# EAGLE design lab_sist_dig (EAGLE 9.6.2)
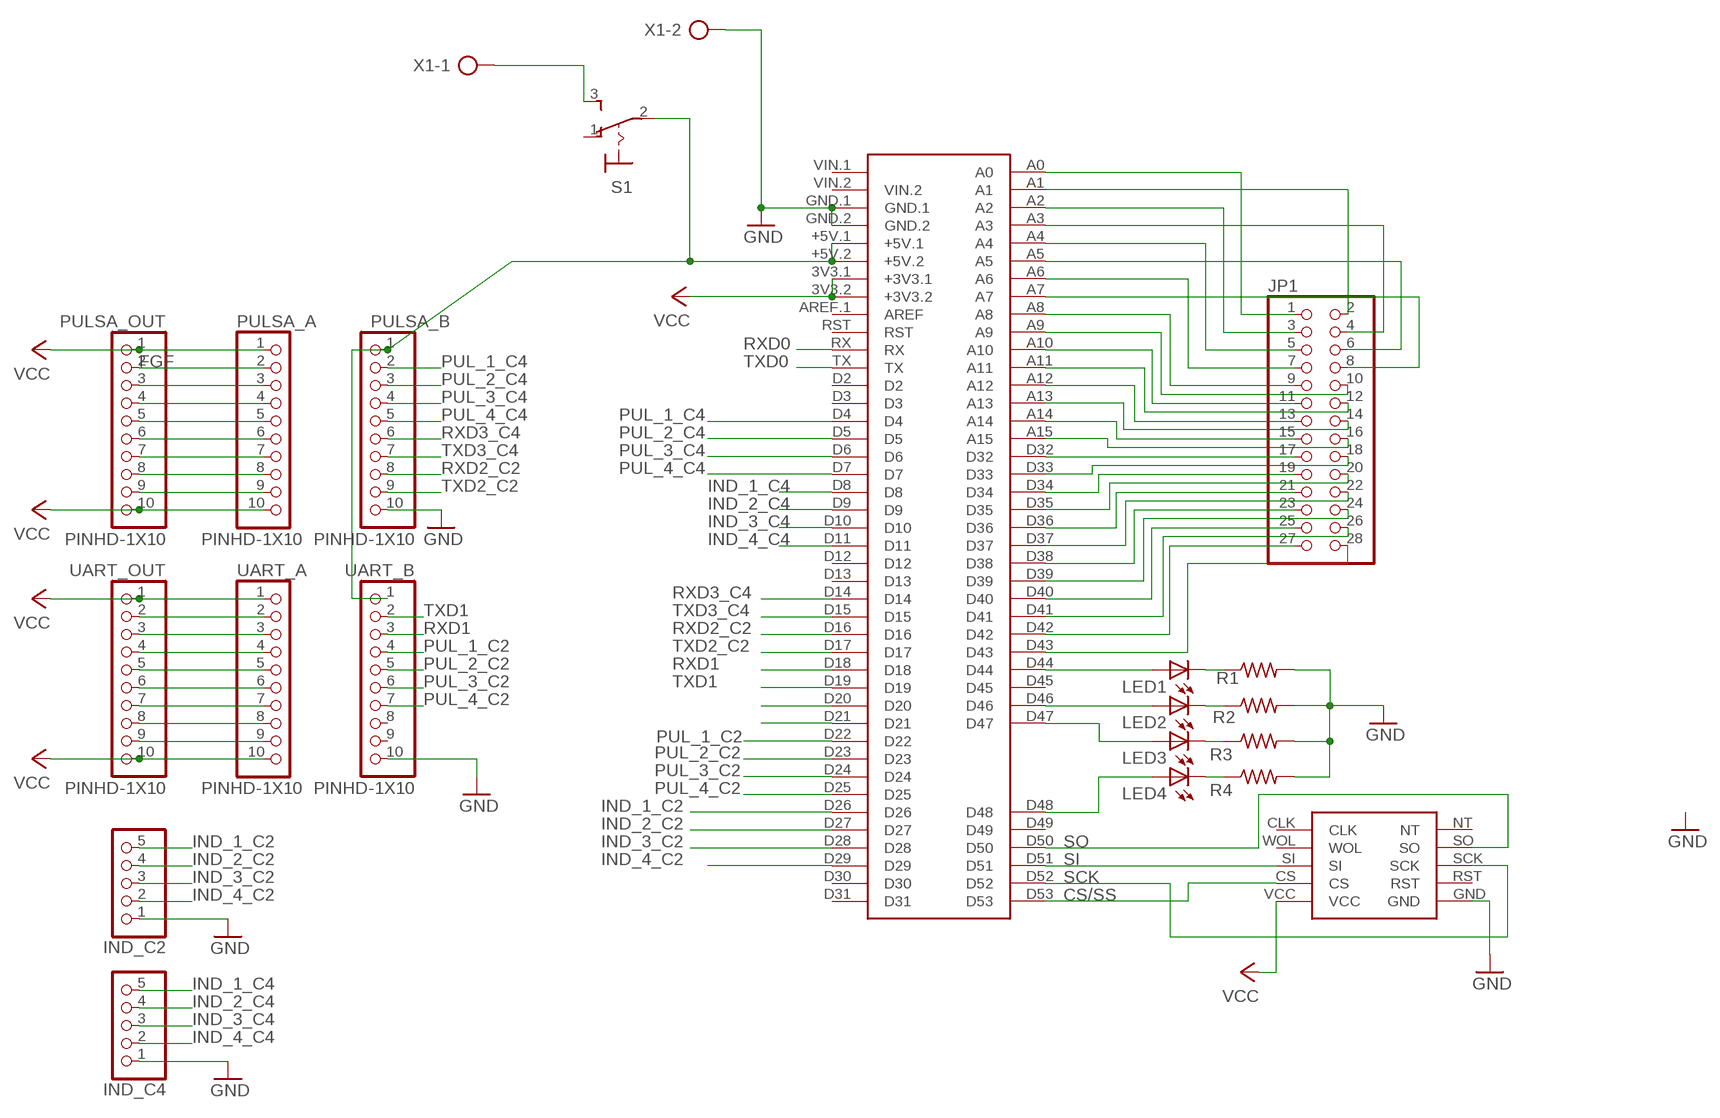
[diagram p0: schematic, sheet 1]

## Parts
IND_C2  PINHD-1X5  [1X05]
IND_C4  PINHD-1X5  [1X05]
JP1  PINHD-2X14  [2X14]
LED1  LED3MM  [LED3MM]
LED2  LED3MM  [LED3MM]
LED3  LED3MM  [LED3MM]
LED4  LED3MM  [LED3MM]
PULSA_A  PINHD-1X10  [1X10-BIG]
PULSA_B  PINHD-1X10  [1X10-BIG]
PULSA_OUT  PINHD-1X10  [1X10-BIG]
R1  FLIPFLOP-RES  [0805-THM]
R2  FLIPFLOP-RES  [0805-THM]
R3  FLIPFLOP-RES  [0805-THM]
R4  FLIPFLOP-RES  [0805-THM]
S1  320-916  [320-916]
U$1  MEGA2560_MIKRO  [MEGA2560_MIKRO]
U$2  ENC28J60  [ENC28J60]
UART_A  PINHD-1X10  [1X10-BIG]
UART_B  PINHD-1X10  [1X10-BIG]
UART_OUT  PINHD-1X10  [1X10-BIG]
X1  AK300/2  [AK300/2]

## Nets
CS/SS: U$1.D53 U$2.CS
FGF: PULSA_A.2 PULSA_OUT.2
GND: IND_C2.1 IND_C4.1 PULSA_B.10 R1.2 R2.2 R3.2 R4.2 U$1.GND.1 U$1.GND.2 U$2.GND UART_B.10 X1.2
IND_1_C2: IND_C2.5 U$1.D26
IND_1_C4: IND_C4.5 U$1.D8
IND_2_C2: IND_C2.4 U$1.D27
IND_2_C4: IND_C4.4 U$1.D9
IND_3_C2: IND_C2.3 U$1.D28
IND_3_C4: IND_C4.3 U$1.D10
IND_4_C2: IND_C2.2 U$1.D29
IND_4_C4: IND_C4.2 U$1.D11
N$1: LED1.A U$1.D44
N$2: LED2.A U$1.D46
N$4: PULSA_A.3 PULSA_OUT.3
N$5: PULSA_A.4 PULSA_OUT.4
N$6: PULSA_A.5 PULSA_OUT.5
N$7: PULSA_A.6 PULSA_OUT.6
N$8: PULSA_A.7 PULSA_OUT.7
N$9: PULSA_A.8 PULSA_OUT.8
N$10: PULSA_A.9 PULSA_OUT.9
N$11: U$1.D20
N$12: U$1.D21
N$13: UART_A.2 UART_OUT.2
N$14: PULSA_B.1 S1.2(P) U$1.+5V.1 U$1.+5V.2 UART_B.1
N$15: UART_A.3 UART_OUT.3
N$16: UART_A.5 UART_OUT.5
N$17: UART_A.4 UART_OUT.4
N$18: UART_A.6 UART_OUT.6
N$19: UART_A.7 UART_OUT.7
N$20: UART_A.8 UART_OUT.8
N$21: UART_A.9 UART_OUT.9
N$22: S1.3(S) X1.1
N$23: JP1.1 U$1.A0
N$24: JP1.2 U$1.A1
N$25: JP1.3 U$1.A2
N$26: JP1.7 U$1.A6
N$27: JP1.5 U$1.A4
N$28: JP1.6 U$1.A5
N$29: LED3.A U$1.D47
N$30: LED4.A U$1.D48
N$31: LED1.K(C) R1.1
N$32: LED2.K(C) R2.1
N$33: JP1.4 U$1.A3
N$34: LED3.K(C) R3.1
N$35: LED4.K(C) R4.1
N$36: JP1.8 U$1.A7
N$37: JP1.9 U$1.A8
N$38: JP1.11 U$1.A10
N$39: JP1.13 U$1.A12
N$40: JP1.15 U$1.A14
N$41: JP1.17 U$1.D32
N$42: JP1.19 U$1.D34
N$43: JP1.21 U$1.D36
N$44: JP1.23 U$1.D38
N$45: JP1.25 U$1.D40
N$46: JP1.16 U$1.A15
N$47: JP1.10 U$1.A9
N$48: JP1.20 U$1.D35
N$49: JP1.12 U$1.A11
N$50: JP1.14 U$1.A13
N$51: JP1.18 U$1.D33
N$52: JP1.22 U$1.D37
N$53: JP1.24 U$1.D39
N$54: JP1.26 U$1.D41
N$55: JP1.27 U$1.D42
N$56: JP1.28 U$1.D43
PUL_1_C2: U$1.D22 UART_B.4
PUL_1_C4: PULSA_B.2 U$1.D4
PUL_2_C2: U$1.D23 UART_B.5
PUL_2_C4: PULSA_B.3 U$1.D5
PUL_3_C2: U$1.D24 UART_B.6
PUL_3_C4: PULSA_B.4 U$1.D6
PUL_4_C2: U$1.D25 UART_B.7
PUL_4_C4: PULSA_B.5 U$1.D7
RXD0: U$1.RX
RXD1: U$1.D18 UART_B.3
RXD2_C2: PULSA_B.8 U$1.D16
RXD3_C4: PULSA_B.6 U$1.D14
SCK: U$1.D52 U$2.SCK
SI: U$1.D51 U$2.SI
SO: U$1.D50 U$2.SO
TXD0: U$1.TX
TXD1: U$1.D19 UART_B.2
TXD2_C2: PULSA_B.9 U$1.D17
TXD3_C4: PULSA_B.7 U$1.D15
VCC: PULSA_A.1 PULSA_A.10 PULSA_OUT.1 PULSA_OUT.10 U$1.3V3.1(+3V3.1) U$1.3V3.2(+3V3.2) U$2.VCC UART_A.1 UART_A.10 UART_OUT.1 UART_OUT.10
Unconnected: S1.1(O) U$1.AREF.1(AREF) U$1.D2 U$1.D3 U$1.D12 U$1.D13 U$1.D30 U$1.D31 U$1.D45 U$1.D49 U$1.RST U$1.VIN.1 U$1.VIN.2 U$2.CLK U$2.NT U$2.RST U$2.WOL UART_B.8 UART_B.9

## Library data of the parts
IND_C2 IND_C4 = pinhead:PINHD-1X5: PIN HEADER
JP1 = adafruit:PINHD-2X14: PIN HEADER
LED1-LED4 = adafruit:LED: LED OSRAM: - CHIPLED LG R971, LG N971, LY N971, LG Q971, LY Q971, LO R971, LY R971 LH N974, LH R974 LS Q976, LO Q976, LY Q976 LO Q996 - Hyper CHIPLED LW Q18S LB Q993, LB Q99A, LB R99A - SideLED LS A670, LO A670, LY A670, LG A670, LP A670 LB A673, LV A673, LT A673, LW A673 LH A674 LY A675 LS A676, LA A676, LO A676, LY A676, LW A676 LS A679, LY A679, LG A679 - Hyper Micro SIDELED® LS Y876, LA Y876, LO Y876, LY Y876 LT Y87S - SmartLED LW L88C, LW L88S LB L89C, LB L89S, LG L890 LS L89K, LO L89K, LY L89K LS L896, LA L896, LO L896, LY L896 - TOPLED LS T670, LO T670, LY T670, LG T670, LP T670 LSG T670, LSP T670, LSY T670, LOP T670, LYG T670 LG T671, LOG T671, LSG T671 LB T673, LV T673, LT T673, LW T673 LH T674 LS T676, LA T676, LO T676, LY T676, LB T676, LH T676, LSB T676, LW T676 LB T67C, LV T67C, LT T67C, LS T67K, LO T67K, LY T67K, LW E67C LS E67B, LA E67B, LO E67B, LY E67B, LB E67C, LV E67C, LT E67C LW T67C LS T679, LY T679, LG T679 LS T770, LO T770, LY T770, LG T770, LP T770 LB T773, LV T773, LT T773, LW T773 LH T774 LS E675, LA E675, LY E675, LS T675 LS T776, LA T776, LO T776, LY T776, LB T776 LHGB T686 LT T68C, LB T68C - Hyper Mini TOPLED® LB M676 - Mini TOPLED Santana® LG M470 LS M47K, LO M47K, LY M47K Source: http://www.osram.convergy.de/
PULSA_A PULSA_B PULSA_OUT UART_A UART_B UART_OUT = adafruit:PINHD-1X10: Pin header 1x10 0.1" spacing With round pins
R1-R4 = adafruit:FLIPFLOP-RES: Flip Flop resistor An 0805 resistor inside a standard 1/4W 5% resistor. Makes for easy mods
S1 = switch:320-916: TOGGLE SWITCH distributor RS Components
U$1 = MIKRO_MEGA2560:MEGA2560_MIKRO: Arduino Mega2560 pro robotDyn, create by mikroavr.com
U$2 = ethernet-mikroavr:ENC28J60: ENC28J60, SHIELD EHTERNET, CREATE BY MIKROAVR.COM
X1 = con-ptr500:AK300/2: CONNECTOR; OC_FARNELL: unknown; OC_NEWARK: unknown

## Board
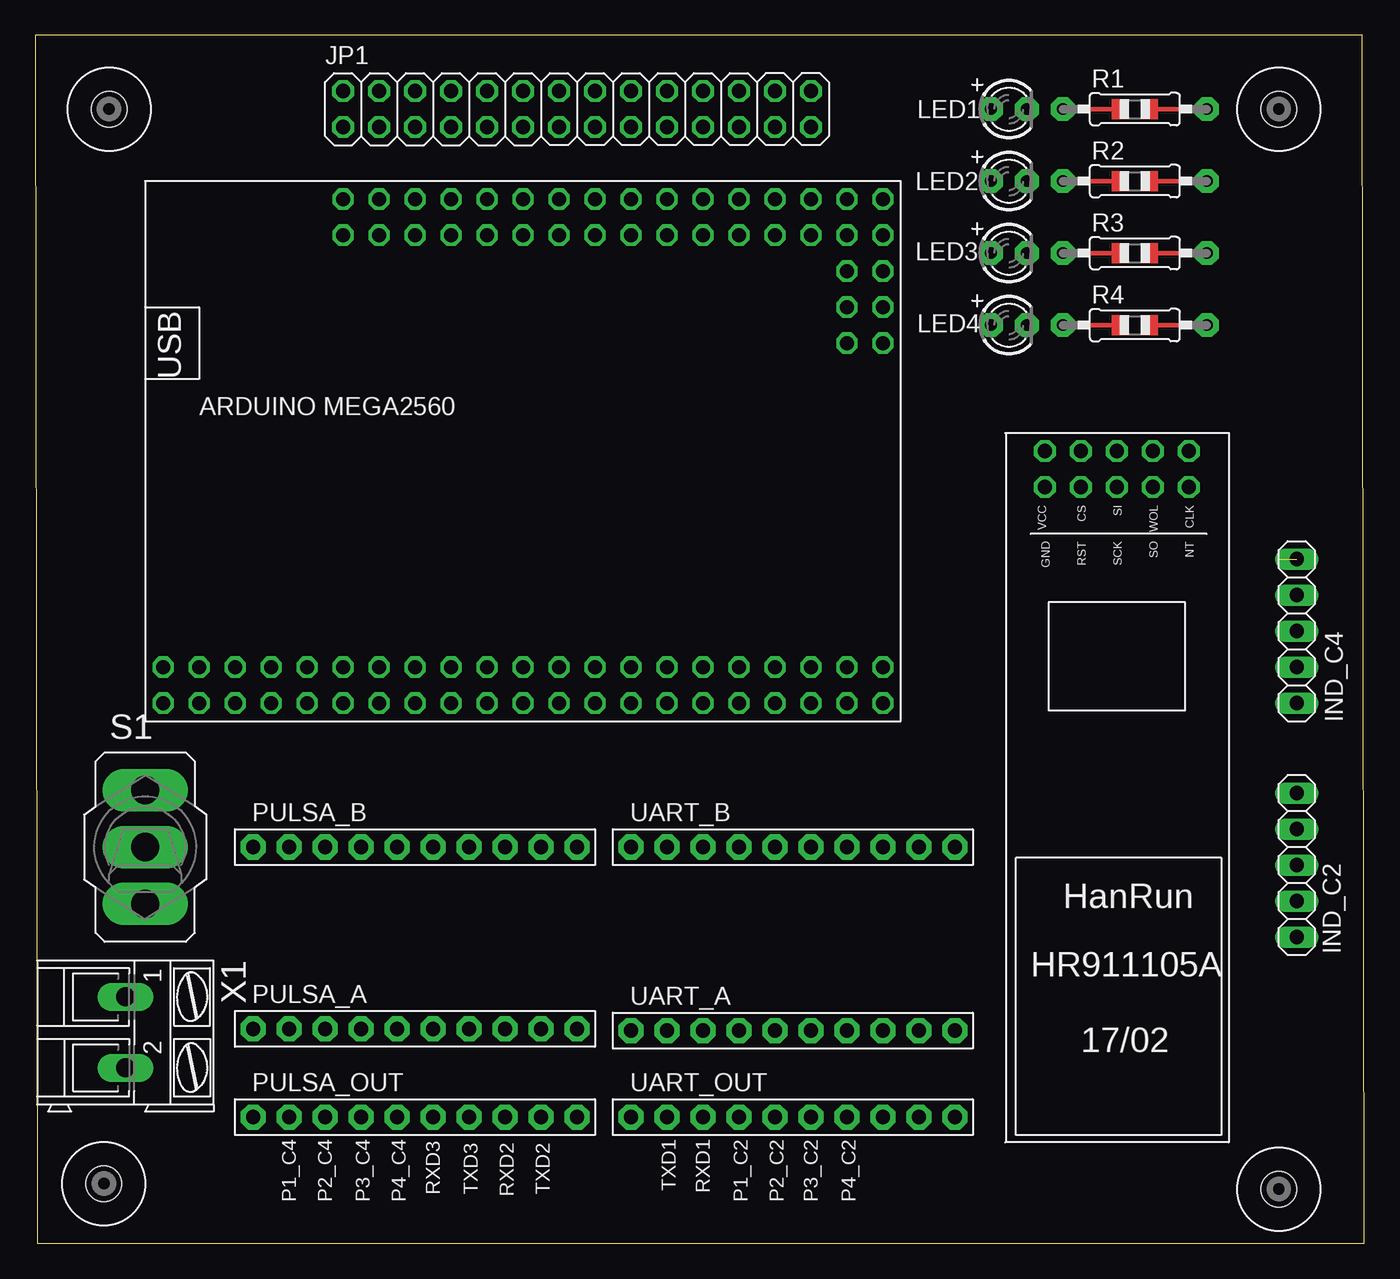
[diagram p1: board, top side]
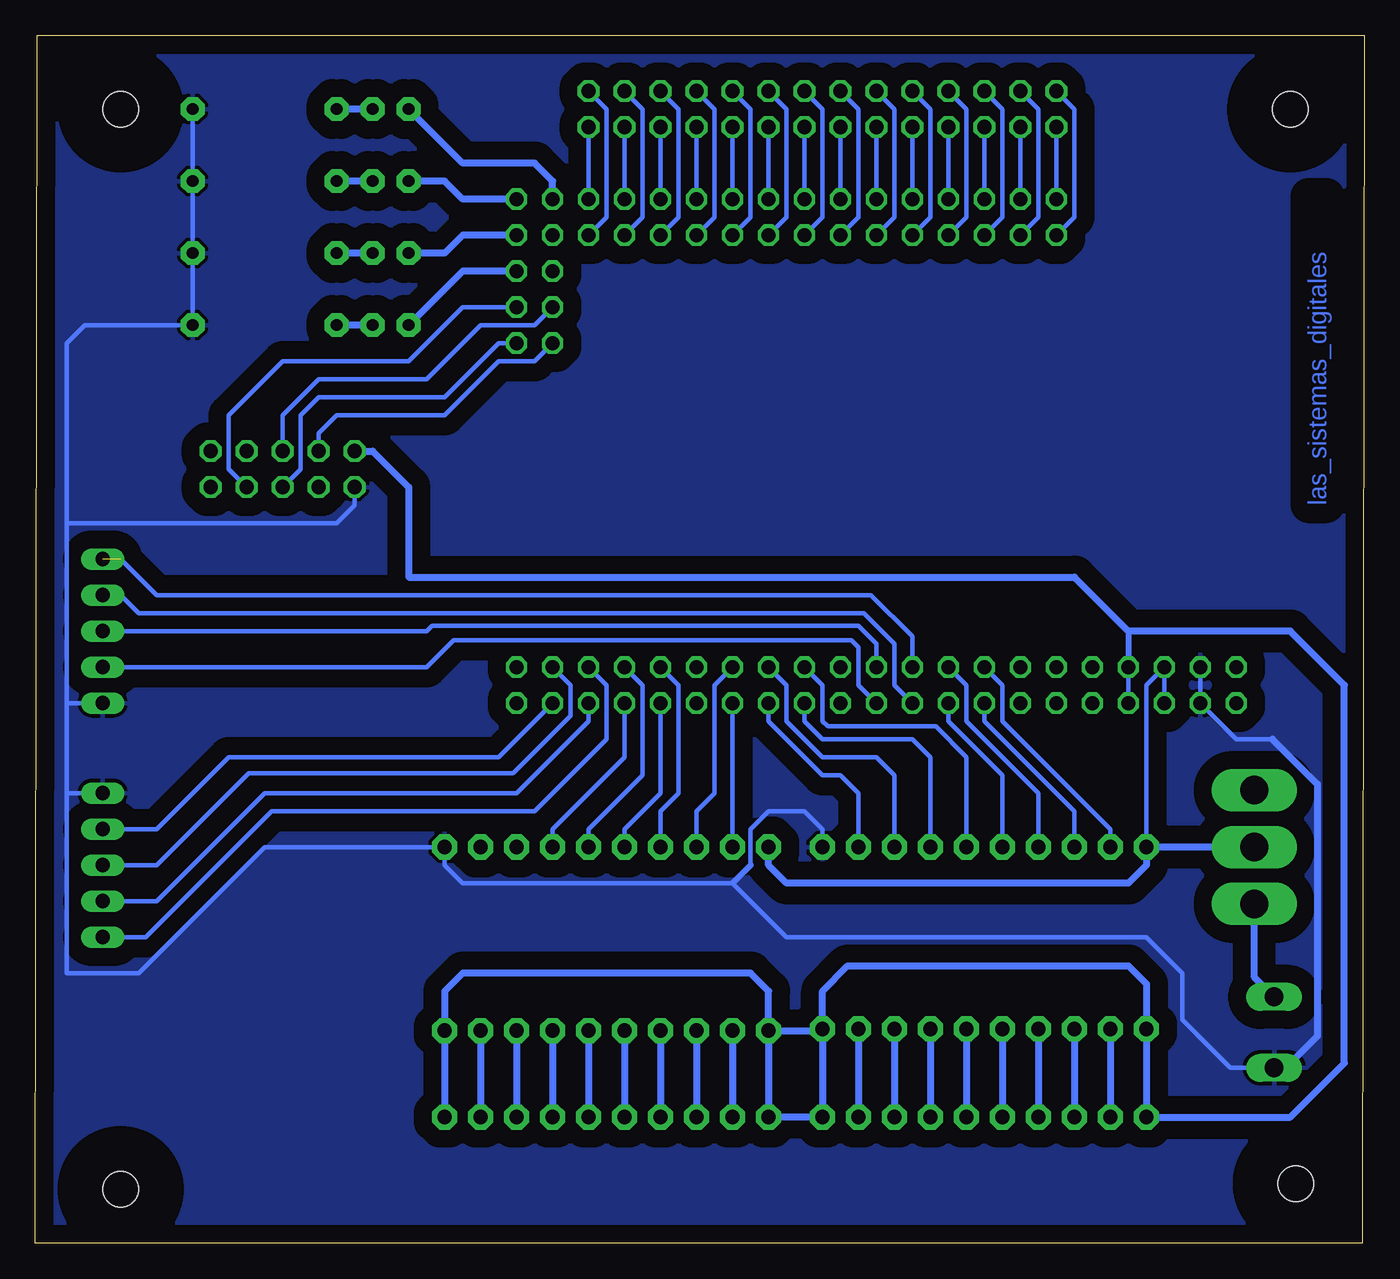
[diagram p2: board, bottom side, seen from below]

Size 93.78 x 85.21 mm. Coordinates in mm from the lower left corner, seen from the top.
Outline: 0.13,0 93.78,0 93.65,85.21 0,85.21 0.13,0
Copper layers (1*16): Top 0.035mm / dielectric 1.5mm / Bottom 0.035mm
Design rules "default": minimum track width 6mil, minimum drill 0.35mm, track to track 6mil, track to pad 6mil, pad to pad 6mil, via to via 6mil, smd to smd 6mil, copper to edge 40mil, drill to drill 6mil, minimum pad ring 10mil, minimum via ring 8mil, stop-mask expansion 4mil, vias tented up to drill 0mil, thermal gap 10mil

### Footprints (pad centres in the part's own frame; a part is rotated, then mirrored left to right if it is on the bottom)
1X05 = drill 1.016 long: 1 -5.08,0; 2 -2.54,0; 3 0,0; 4 2.54,0; 5 5.08,0
2X14 = drill 1.016 octagon: 1 -16.51,-1.27; 2 -16.51,1.27; 3 -13.97,-1.27; 4 -13.97,1.27; 5 -11.43,-1.27; 6 -11.43,1.27; 7 -8.89,-1.27; 8 -8.89,1.27; 9 -6.35,-1.27; 10 -6.35,1.27; 11 -3.81,-1.27; 12 -3.81,1.27; 13 -1.27,-1.27; 14 -1.27,1.27; 15 1.27,-1.27; 16 1.27,1.27; 17 3.81,-1.27; 18 3.81,1.27; 19 6.35,-1.27; 20 6.35,1.27; 21 8.89,-1.27; 22 8.89,1.27; 23 11.43,-1.27; 24 11.43,1.27; 25 13.97,-1.27; 26 13.97,1.27; 27 16.51,-1.27; 28 16.51,1.27
LED3MM = drill 0.813 pad 1.676 octagon: A -1.27,0; K 1.27,0
1X10-BIG = drill 1.016 pad 1.778 octagon: 1 -11.43,0; 2 -8.89,0; 3 -6.35,0; 4 -3.81,0; 5 -1.27,0; 6 1.27,0; 7 3.81,0; 8 6.35,0; 9 8.89,0; 10 11.43,0
0805-THM = drill 0.813 pad 1.676 octagon: 1 -5.08,0; 2 5.08,0
320-916 = drill 2.007 long: 1 0,4.013; 2 0,0; 3 0,-4.013
MEGA2560_MIKRO = drill 1 octagon: 3V3.1 -26.67,-17.78; 3V3.2 -26.67,-20.32; +5V.1 -29.21,-17.78; +5V.2 -29.21,-20.32; A0 -21.59,15.24; A1 -21.59,12.7; A2 -19.05,15.24; A3 -19.05,12.7; A4 -16.51,15.24; A5 -16.51,12.7; A6 -13.97,15.24; A7 -13.97,12.7; A8 -11.43,15.24; A9 -11.43,12.7; A10 -8.89,15.24; A11 -8.89,12.7; A12 -6.35,15.24; A13 -6.35,12.7; A14 -3.81,15.24; A15 -3.81,12.7; AREF.1 -24.13,-17.78; D2 -19.05,-17.78; D3 -19.05,-20.32; D4 -16.51,-17.78; D5 -16.51,-20.32; D6 -13.97,-17.78; D7 -13.97,-20.32; D8 -11.43,-17.78; D9 -11.43,-20.32; D10 -8.89,-17.78; D11 -8.89,-20.32; D12 -6.35,-17.78; D13 -6.35,-20.32; D14 -3.81,-17.78; D15 -3.81,-20.32; D16 -1.27,-17.78; D17 -1.27,-20.32; D18 1.27,-17.78; D19 1.27,-20.32; D20 3.81,-17.78; D21 3.81,-20.32; D22 6.35,-17.78; D23 6.35,-20.32; D24 8.89,-17.78; D25 8.89,-20.32; D26 11.43,-17.78; D27 11.43,-20.32; D28 13.97,-17.78; D29 13.97,-20.32; D30 16.51,-17.78; D31 16.51,-20.32; D32 -1.27,15.24; D33 -1.27,12.7; D34 1.27,15.24; D35 1.27,12.7; D36 3.81,15.24; D37 3.81,12.7; D38 6.35,15.24; D39 6.35,12.7; D40 8.89,15.24; D41 8.89,12.7; D42 11.43,15.24; D43 11.43,12.7; D44 13.97,15.24; D45 13.97,12.7; D46 16.51,15.24; D47 16.51,12.7; D48 16.51,10.16; D49 13.97,10.16; D50 16.51,7.62; D51 13.97,7.62; D52 16.51,5.08; D53 13.97,5.08; GND.1 -31.75,-17.78; GND.2 -31.75,-20.32; RST -24.13,-20.32; RX -21.59,-17.78; TX -21.59,-20.32; VIN.1 -34.29,-17.78; VIN.2 -34.29,-20.32
ENC28J60 = drill 1.016 octagon: CLK 1.27,2.54; CS 1.27,-5.08; GND 3.81,-7.62; NT 3.81,2.54; RST 3.81,-5.08; SCK 3.81,-2.54; SI 1.27,-2.54; SO 3.81,0; VCC 1.27,-7.62; WOL 1.27,0
DRIL-2,5 = hole 2.5: 0,0
AK300/2 = drill 1.321 long: 1 -2.515,0; 2 2.489,0

### Placement (x,y rotation side)
IND_C2  89.03,26.67 270 top
IND_C4  89.03,43.18 90 top
JP1  38.23,80.01 0 top
LED1  68.71,80.01 0 top
LED2  68.71,74.93 0 top
LED3  68.71,69.85 0 top
LED4  68.71,64.77 0 top
PULSA_A  26.8,15.11 0 top
PULSA_B  26.8,27.94 0 top
PULSA_OUT  26.8,8.89 0 top
R1  77.6,80.01 0 top
R2  77.6,74.93 0 top
R3  77.6,69.85 0 top
R4  77.6,64.77 0 top
S1  7.75,27.94 0 top
U$1  43.31,58.42 0 top
U$2  78.87,57.15 270 top
U$3  [DRIL-2,5]  4.83,4.19 0 top
U$4  [DRIL-2,5]  87.76,3.81 0 top
U$5  [DRIL-2,5]  5.21,80.01 0 top
U$6  [DRIL-2,5]  87.76,80.01 0 top
UART_A  53.47,14.99 0 top
UART_B  53.47,27.94 0 top
UART_OUT  53.47,8.89 0 top
X1  6.35,14.86 270 top

### Tracks (layer width: path | path; a pad name or v marks a point on that pad's centre or on a via)
CS/SS
  Bottom 0.305: U$1.D53 58.55,62.23 61.09,62.23 64.9,58.42 72.52,58.42 73.79,57.15 U$2.CS
FGF
  Bottom 0.508: PULSA_A.2 PULSA_OUT.2
GND
  Bottom 0.305: 91.57,50.8 91.57,63.5 90.3,64.77 R4.2 R3.2 R2.2 R1.2 | 91.57,50.8 91.57,38.1 | 91.57,38.1 91.57,31.75 | 91.57,31.75 91.57,19.05 86.49,19.05 77.6,27.94 UART_B.10 64.9,26.67 63.63,25.4 44.58,25.4 40.77,21.59 15.37,21.59 12.83,19.05 12.83,15.75 9.45,12.37 X1.2 6.3,12.32 | IND_C2.1 91.57,31.75 | IND_C4.1 91.57,38.1 | U$2.GND 71.25,52.07 72.52,50.8 91.57,50.8 | PULSA_B.10 38.23,29.21 39.5,30.48 42.04,30.48 43.31,29.21 43.31,26.67 | U$1.GND.1 U$1.GND.2 9.02,35.56 6.48,35.56
  Bottom 0.406: 43.31,26.67 44.58,25.4
  Bottom 0.508: 6.48,35.56 3.3,32.38 3.3,14.61 5.54,12.37 X1.2
  pour Bottom (isolate 1.27): 0.76,0.64 0.76,84.07 92.96,84.07 92.96,0.64
IND_1_C2
  Bottom 0.305: U$1.D26 53.47,39.37 53.47,35.56 58.55,30.48 77.09,30.48 85.98,21.59 IND_C2.5
IND_1_C4  (1 unrouted)
  Bottom 0.305: U$1.D8 31.88,42.8 34.8,45.72 35.69,45.72 85.22,45.72 87.76,48.26
IND_2_C2
  Bottom 0.305: U$1.D27 54.74,36.83 59.82,31.75 77.6,31.75 85.22,24.13 IND_C2.4
IND_2_C4
  Bottom 0.305: U$1.D9 33.15,39.37 33.15,42.29 35.31,44.45 86.49,44.45 87.76,45.72 IND_C4.4
IND_3_C2
  Bottom 0.305: U$1.D28 56.01,39.37 56.01,37.21 60.07,33.15 78.74,33.15 85.22,26.67 IND_C2.3
IND_3_C4
  Bottom 0.305: IND_C4.3 66.17,43.18 65.79,43.56 35.69,43.56 34.42,42.29 U$1.D10
IND_4_C2
  Bottom 0.305: U$1.D29 61.09,34.29 80.14,34.29 85.22,29.21 IND_C2.2
IND_4_C4
  Bottom 0.305: U$1.D11 35.69,39.37 35.69,42.04 36.2,42.54 64.26,42.54 66.17,40.64 IND_C4.2
N$1
  Bottom 0.508: U$1.D44 57.28,74.93 58.55,76.2 63.63,76.2 LED1.A
N$2
  Bottom 0.508: U$1.D46 63.63,73.66 64.9,74.93 LED2.A
N$4
  Bottom 0.508: PULSA_A.3 PULSA_OUT.3
N$5
  Bottom 0.508: PULSA_A.4 PULSA_OUT.4
N$6
  Bottom 0.508: PULSA_A.5 PULSA_OUT.5
N$7
  Bottom 0.508: PULSA_A.6 PULSA_OUT.6
N$8
  Bottom 0.508: PULSA_A.7 PULSA_OUT.7
N$9
  Bottom 0.508: PULSA_A.8 PULSA_OUT.8
N$10
  Bottom 0.508: PULSA_A.9 PULSA_OUT.9
N$13
  Bottom 0.508: UART_A.2 UART_OUT.2
N$14
  Bottom 0.305: PULSA_B.1 15.37,39.37 U$1.+5V.1 U$1.+5V.2
  Bottom 0.508: S1.2 PULSA_B.1 15.37,26.67 16.64,25.4 40.77,25.4 42.04,26.67 UART_B.1
N$15
  Bottom 0.508: UART_A.3 UART_OUT.3
N$16
  Bottom 0.508: UART_A.5 UART_OUT.5
N$17
  Bottom 0.508: UART_A.4 UART_OUT.4
N$18
  Bottom 0.508: UART_A.6 UART_OUT.6
N$19
  Bottom 0.508: UART_A.7 UART_OUT.7
N$20
  Bottom 0.508: UART_A.8 UART_OUT.8
N$21
  Bottom 0.508: UART_A.9 UART_OUT.9
N$22
  Bottom 0.508: X1.1 7.75,18.77 S1.3
N$23
  Bottom 0.305: U$1.A0 JP1.1
N$24
  Bottom 0.305: U$1.A1 20.45,72.39 20.45,80.01 JP1.2
N$25
  Bottom 0.305: U$1.A2 JP1.3
N$26
  Bottom 0.305: U$1.A6 JP1.7
N$27
  Bottom 0.305: U$1.A4 JP1.5
N$28
  Bottom 0.305: U$1.A5 25.53,72.39 25.53,80.01 JP1.6
N$29
  Bottom 0.508: U$1.D47 63.63,71.12 64.9,69.85 LED3.A
N$30
  Bottom 0.508: U$1.D48 63.63,68.58 LED4.A
N$31
  Bottom 0.508: LED1.K R1.1
N$32
  Bottom 0.508: LED2.K R2.1
N$33
  Bottom 0.305: U$1.A3 22.99,72.39 22.99,80.01 JP1.4
N$34
  Bottom 0.508: LED3.K R3.1
N$35
  Bottom 0.508: LED4.K R4.1
N$36
  Bottom 0.305: U$1.A7 28.07,72.39 28.07,80.01 JP1.8
N$37
  Bottom 0.305: U$1.A8 JP1.9
N$38
  Bottom 0.305: U$1.A10 JP1.11
N$39
  Bottom 0.305: U$1.A12 JP1.13
N$40
  Bottom 0.305: U$1.A14 JP1.15
N$41
  Bottom 0.305: U$1.D32 JP1.17
N$42
  Bottom 0.305: U$1.D34 JP1.19
N$43
  Bottom 0.305: U$1.D36 JP1.21
N$44
  Bottom 0.305: U$1.D38 JP1.23
N$45
  Bottom 0.305: U$1.D40 JP1.25
N$46
  Bottom 0.305: U$1.A15 38.23,72.39 38.23,80.01 JP1.16
N$47
  Bottom 0.305: U$1.A9 30.61,72.39 30.61,80.01 JP1.10
N$48
  Bottom 0.305: U$1.D35 43.31,72.39 43.31,80.01 JP1.20
N$49
  Bottom 0.305: U$1.A11 33.15,72.39 33.15,80.01 JP1.12
N$50
  Bottom 0.305: U$1.A13 35.69,72.39 35.69,80.01 JP1.14
N$51
  Bottom 0.305: U$1.D33 40.77,72.39 40.77,80.01 JP1.18
N$52
  Bottom 0.305: U$1.D37 45.85,72.39 45.85,80.01 JP1.22
N$53
  Bottom 0.305: U$1.D39 48.39,72.39 48.39,80.01 JP1.24
N$54
  Bottom 0.305: U$1.D41 50.93,72.39 50.93,80.01 JP1.26
N$55
  Bottom 0.305: U$1.D42 JP1.27
N$56
  Bottom 0.305: U$1.D43 53.47,72.39 53.47,80.01 JP1.28
PUL_1_C2
  Bottom 0.305: U$1.D22 48.39,39.37 48.39,31.75 49.66,30.48 UART_B.4
PUL_1_C4
  Bottom 0.305: U$1.D4 25.53,39.37 25.53,36.83 17.91,29.21 PULSA_B.2
PUL_2_C2
  Bottom 0.305: U$1.D23 49.66,31.75 52.2,29.21 UART_B.5
PUL_2_C4
  Bottom 0.305: U$1.D5 26.8,36.83 20.45,30.48 PULSA_B.3
PUL_3_C2
  Bottom 0.305: U$1.D24 50.93,39.37 50.93,33.02 54.74,29.21 UART_B.6
PUL_3_C4
  Bottom 0.305: U$1.D6 28.07,39.37 28.07,36.83 22.99,31.75 PULSA_B.4
PUL_4_C2
  Bottom 0.305: U$1.D25 52.2,34.29 57.28,29.21 UART_B.7
PUL_4_C4
  Bottom 0.305: PULSA_B.5 25.53,33.02 29.34,36.83 U$1.D7
RXD1
  Bottom 0.305: U$1.D18 45.85,39.37 45.85,31.75 47.12,30.48 UART_B.3
RXD2_C2
  Bottom 0.305: U$1.D16 40.77,39.37 40.77,36.83 38.23,34.29 34.42,34.29 33.15,33.02 PULSA_B.8
RXD3_C4
  Bottom 0.305: U$1.D14 38.23,39.37 38.23,36.83 37.85,36.45 30.23,36.45 28.07,34.29 PULSA_B.6
SCK
  Bottom 0.305: U$1.D52 61.09,63.5 64.9,59.69 73.79,59.69 75.06,58.42 75.06,54.61 U$2.SCK
SI
  Bottom 0.305: U$1.D51 58.55,64.77 62.36,64.77 66.17,60.96 73.79,60.96 76.33,58.42 U$2.SI
SO
  Bottom 0.305: U$2.SO 80.14,54.61 80.14,58.42 76.33,62.23 67.44,62.23 63.63,66.04 U$1.D50
TXD1
  Bottom 0.305: U$1.D19 UART_B.2
TXD2_C2
  Bottom 0.305: U$1.D17 42.04,36.83 38.23,33.02 36.96,33.02 35.69,31.75 PULSA_B.9
TXD3_C4
  Bottom 0.305: U$1.D15 39.5,36.83 38.23,35.56 31.88,35.56 30.61,34.29 PULSA_B.7
VCC
  Bottom 0.305: U$1.3V3.2 U$1.3V3.1 | PULSA_A.10 38.35,14.99
  Bottom 0.406: 16.64,43.18 U$1.3V3.1
  Bottom 0.508: UART_OUT.10 UART_A.10 64.9,17.78 63.63,19.05 43.31,19.05 42.04,17.78 UART_A.1 | UART_A.1 UART_OUT.1 PULSA_OUT.10 PULSA_A.10 38.23,17.78 36.45,19.56 16.64,19.56 15.37,18.29 PULSA_A.1 PULSA_OUT.1 5.21,8.89 1.4,12.7 1.4,39.37 5.21,43.18 16.64,43.18 20.45,46.99 67.44,46.99 67.44,53.34 69.98,55.88 U$2.VCC | UART_A.1 38.35,14.99

### Text on the board
Bottom: las_sistemas_digitales
tNames: RXD3 | TXD3 | RXD2 | TXD2 | TXD1 | RXD1 | P1_C4 | P2_C4 | P3_C4 | P4_C4 | P1_C2 | P2_C2 | P3_C2 | P4_C2